# EasyEDA Pro project SCH_Workshop-components_2025-10-18.eprj

# Schematic Workshop components
Board Name: Workshop components; Create Date: 2025-10-18; Page Name: LED Lab Components; Project Name: SCH_Workshop-components_2025-10-18; Schematic Name: Workshop components; Update Date: 2025-10-18; Add into BOM: yes; Company: Your Company; Convert to PCB: yes; Date: 2025-02-25; Draw By: johncohnvt; REV: 1.0; Sheet: 1/1; spicePre: .
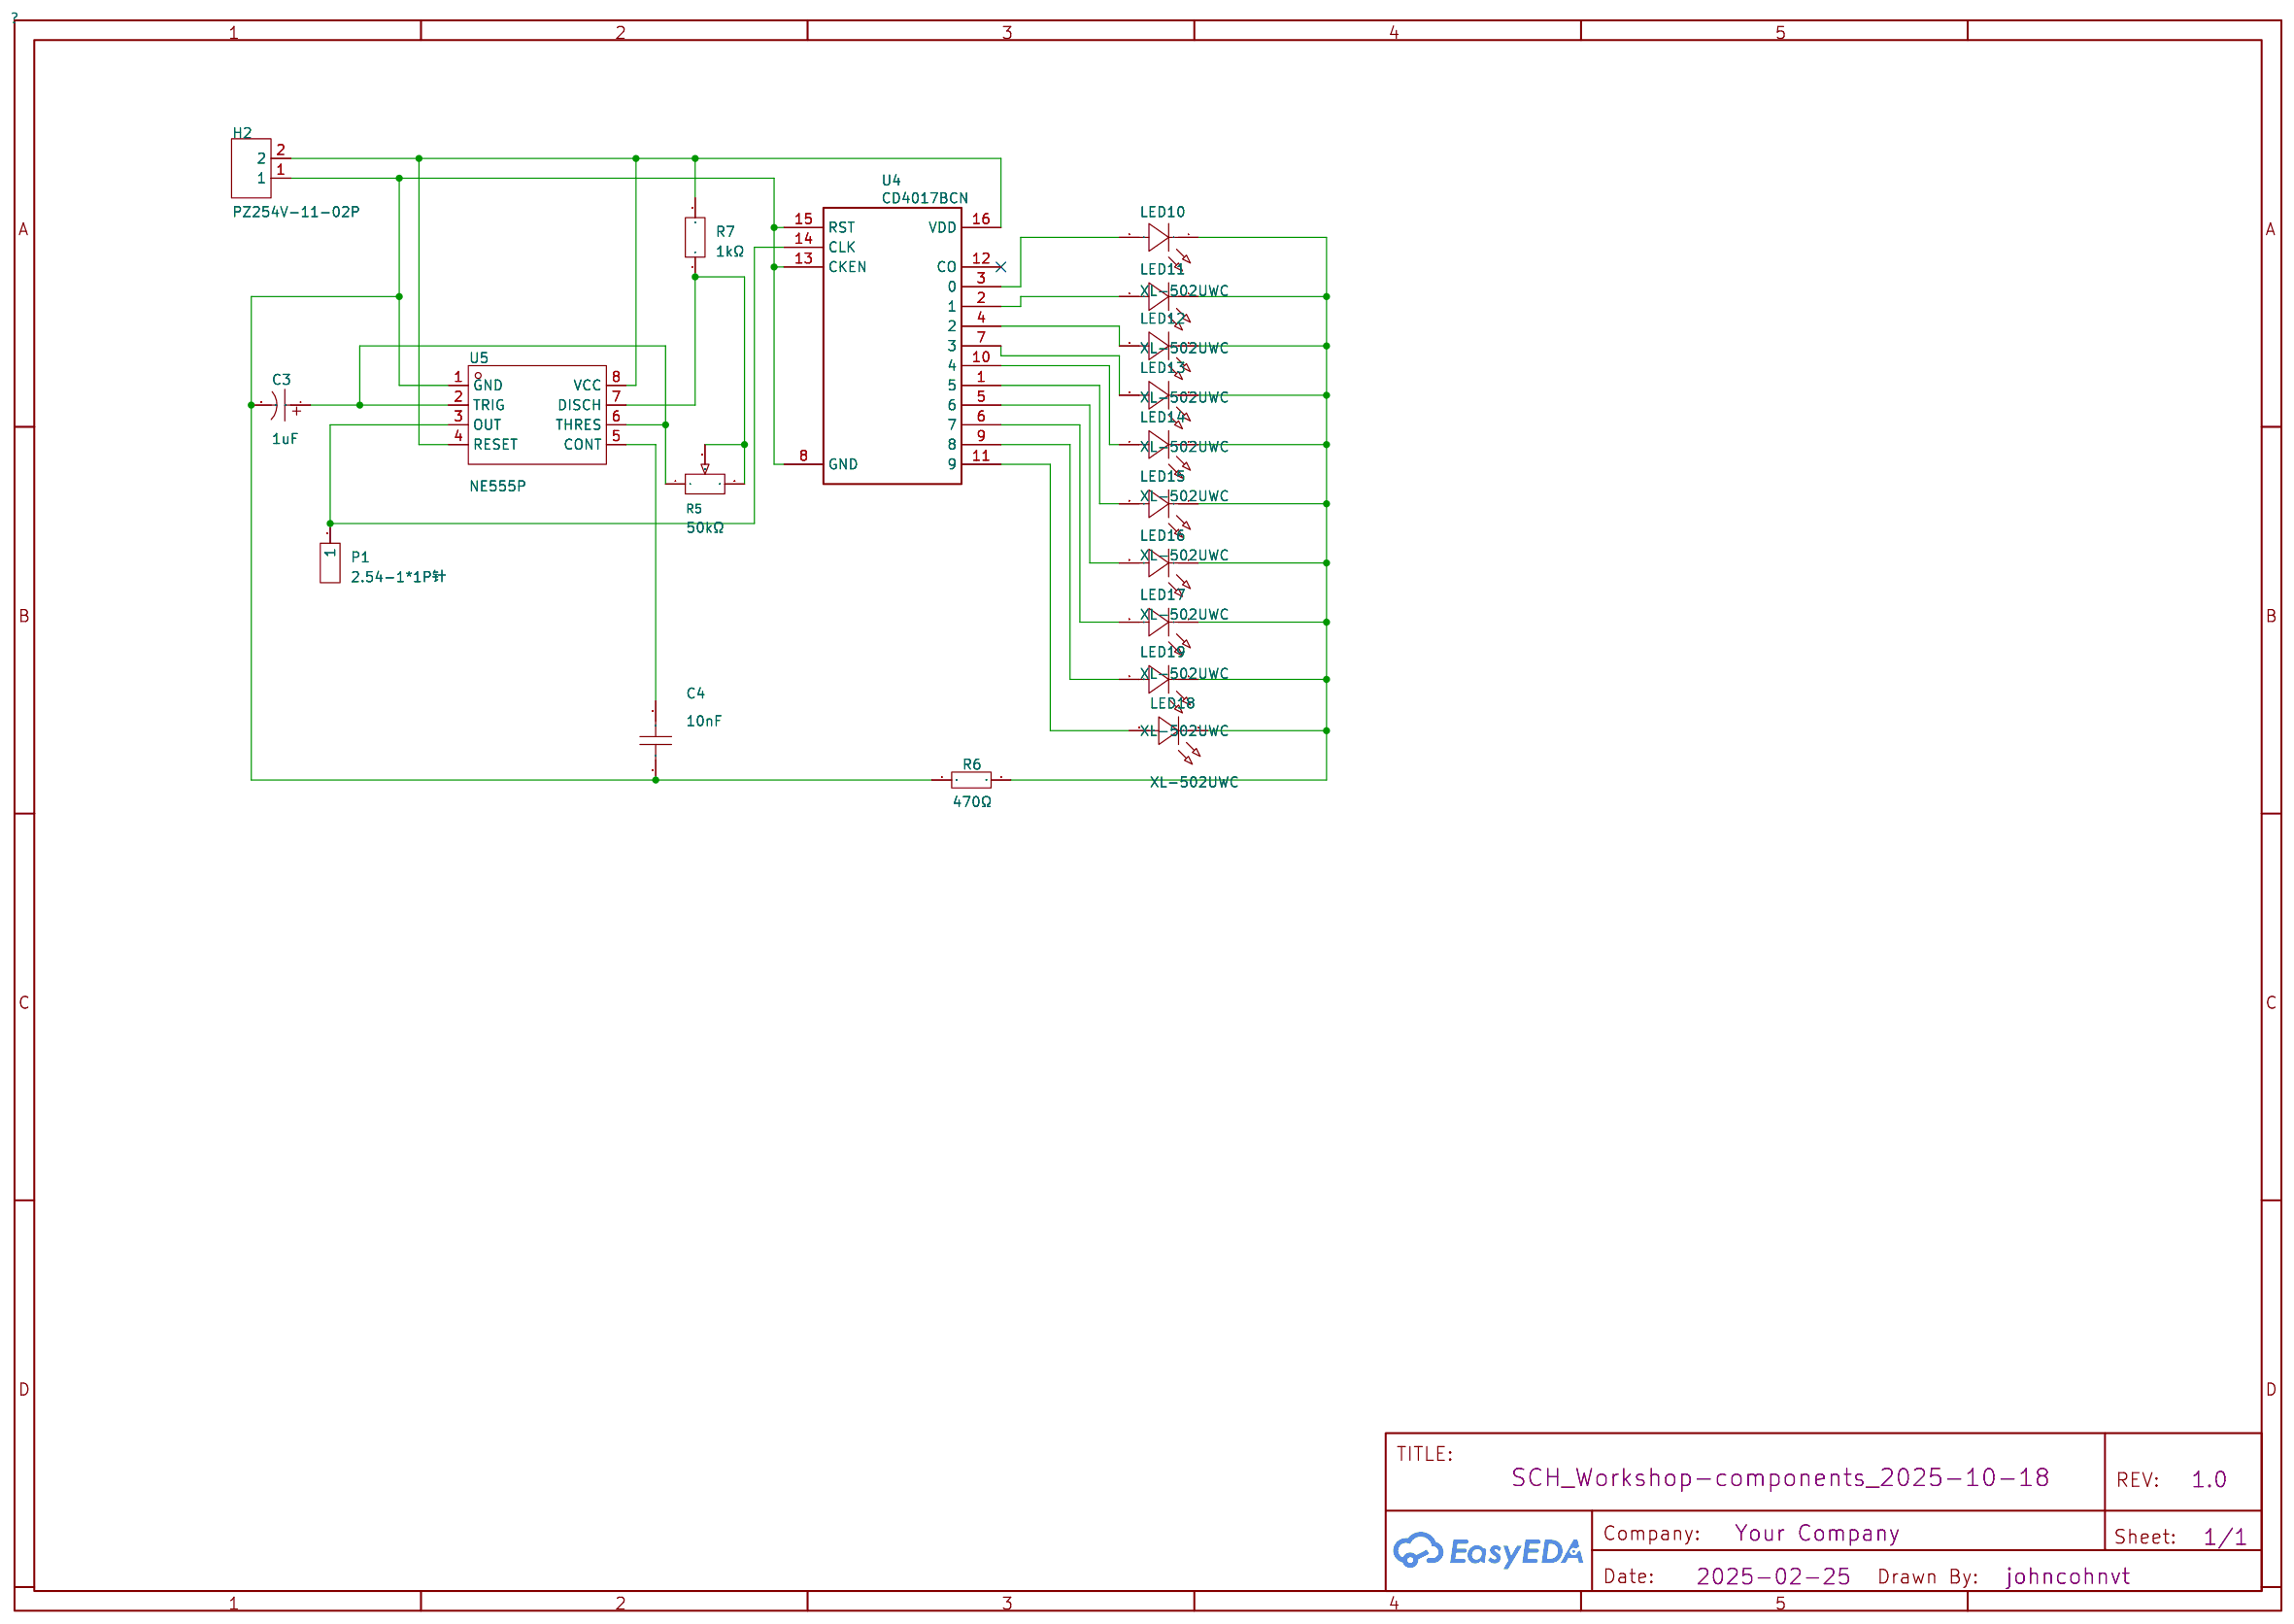
[diagram p0: schematic sheet]

## Parts
C3  1uF  [CAP-TH_BD5.0-P2.00-D0.8-FD]
C4  10nF  [CAP-TH_L8.0-W4.0-P5.00-D1.2]
H2  PZ254V-11-02P  [HDR-TH_2P-P2.54-V-M]
LED10  XL-502UWC  [LED-TH_BD5.9-P2.54-RD_WHITE]
LED11  XL-502UWC  [LED-TH_BD5.9-P2.54-RD_WHITE]
LED12  XL-502UWC  [LED-TH_BD5.9-P2.54-RD_WHITE]
LED13  XL-502UWC  [LED-TH_BD5.9-P2.54-RD_WHITE]
LED14  XL-502UWC  [LED-TH_BD5.9-P2.54-RD_WHITE]
LED15  XL-502UWC  [LED-TH_BD5.9-P2.54-RD_WHITE]
LED16  XL-502UWC  [LED-TH_BD5.9-P2.54-RD_WHITE]
LED17  XL-502UWC  [LED-TH_BD5.9-P2.54-RD_WHITE]
LED18  XL-502UWC  [LED-TH_BD5.9-P2.54-RD_WHITE]
LED19  XL-502UWC  [LED-TH_BD5.9-P2.54-RD_WHITE]
P1  2.54-1*1P针  [HDR-TH_1P-P2.54-V-M]
R5  50kΩ  [RES-ADJ-TH_3P-L9.5-W4.85-P2.50-BL-L]
R6  470Ω  [RES-TH_BD2.2-L6.5-P10.50-D0.6]
R7  1kΩ  [RES-TH_BD2.3-L6.5-P10.50-D0.5]
U4  CD4017BCN  [DIP-16_L19.8-W6.5-P2.54-LS7.6-BL]
U5  NE555P  [DIP-8_L9.8-W6.6-P2.54-LS7.6-BL]

## Library data of the parts
C3 = KF010M050C110A: LCSC Part Name: 1uF ±20% 50V; Supplier Part: C62934; Manufacturer: CapXon(丰宾); Supplier Footprint: 插件,D5xL11mm; JLCPCB Part Class: Extended Part; Datasheet: https://item.szlcsc.com/datasheet/KF010M050C110A/63997.html; Supplier: LCSC; Tolerance: ±20%; Voltage Rating: 50V; Pin Spacing: 2mm; Diameter: 5mm; Height - Seated (Max): 11mm; Lifetime: 2000hrs@105℃
C4 = N09F1B103MN0B0S0N0: LCSC Part Name: 10nF ±20% 1kV; Supplier Part: C249157; Manufacturer: STE(松田); Supplier Footprint: 插件,P=5mm; JLCPCB Part Class: Extended Part; Datasheet: https://item.szlcsc.com/datasheet/N09F1B103MN0B0S0N0/245516.html; Supplier: LCSC; Tolerance: ±20%; Voltage Rating: 1kV; Pin Spacing: 5mm; Temperature Coefficient: Y5V; Diameter: 8.5mm; Body Thickness: 2.5mm
H2 = PZ254V-11-02P: LCSC Part Name: 1x2P 间距:2.54mm 方针 直插; Supplier Part: C492401; Manufacturer: XFCN(兴飞); Supplier Footprint: 插件,P=2.54mm; JLCPCB Part Class: Extended Part; Datasheet: https://item.szlcsc.com/datasheet/PZ254V-11-02P/502957.html; Supplier: LCSC; Pin Structure: 1x2P; Pitch: 2.54mm; Circluar Pins/Square Pins: Pin Header; Mounting Type: Through Hole; Number of Rows: 1; Number of Pins: 2P; Length of Mating Pin: 6mm; Insulation Height: 2.5mm; Length of End Connection Pin: 3mm; Contact Material: Brass; Operating Temperature: -40℃~+105℃; Color: Black
LED10-LED19 = XL-502UWC: LCSC Part Name: F5白发白短脚; Supplier Part: C2895480; Manufacturer: XINGLIGHT(成兴光); Supplier Footprint: 插件,D=5mm; JLCPCB Part Class: Extended Part; Datasheet: https://item.szlcsc.com/datasheet/XL-502UWC/3136195.html; Supplier: LCSC; Lamp Holder Type: 5mm Round Lens; Illumination Color: White; Voltage - Forward(Vf): 3.3V; Power(Watts): 70mW; Forward Current: 20mA; Lens Color: Water Clear; Color Temperature: 9000K~20000K; Luminous Intensity: 20000mcd; Viewing Angle: 30°; Operating Temperature: -25℃~+85℃
P1 = 2.54-1*1P针: LCSC Part Name: 方针 直插; Supplier Part: C81276; Manufacturer: BOOMELE(博穆精密); Supplier Footprint: 插件,P=2.54mm; JLCPCB Part Class: Extended Part; Datasheet: https://item.szlcsc.com/datasheet/2.54-1*1P%25E9%2592%2588/82426.html; Supplier: LCSC; Circluar Pins/Square Pins: Pin Header; Mounting Type: Through Hole; Number of Rows: 1; Number of Pins: 1P; Current Rating: 3A; Length of Mating Pin: 6mm; Insulation Height: 2.5mm; Length of End Connection Pin: 3mm; Contact Material: Brass; Contact Plating: Gold; Operating Temperature: -55℃~+105℃; Color: Black
R5 = 3296X-1-503_C118912: LCSC Part Name: 50kΩ ±10%; Supplier Part: C118912; Manufacturer: BOCHEN(博晨); Manufacturer Part: 3296X-1-503; Supplier Footprint: 插件-3P,9.5x4.9mm; JLCPCB Part Class: Extended Part; Datasheet: https://item.szlcsc.com/datasheet/3296X-1-503/120181.html; Supplier: LCSC; Tolerance: ±10%; Power(Watts): 500mW; Temperature Coefficient: ±250ppm/℃; Number of Turns: 30
R6 = MFR0W4F4700A50: LCSC Part Name: 470Ω ±1% 250mW 金属膜电阻 铜脚，圆柱状直插; Supplier Part: C58592; Manufacturer: UNI-ROYAL(厚声); Supplier Footprint: 插件,D2.2xL6.5mm; JLCPCB Part Class: Extended Part; Datasheet: https://atta.szlcsc.com/upload/public/pdf/source/20191012/C436293_8820AA14BC71FA35E551C06C441482A0.pdf; Supplier: LCSC; Type: Metal Film Resistors; Tolerance: ±1%; Voltage-Supply(Max): 250V; Power(Watts): 250mW; Temperature Coefficient: ±50ppm/℃
R7 = MF1/4W-1KΩ±1%T52: LCSC Part Name: 金属膜电阻 1kΩ ±1% 250mW; Supplier Part: C713997; Manufacturer: 华星机电; Supplier Footprint: 插件,D2.3xL6.5mm; JLCPCB Part Class: Extended Part; Datasheet: https://atta.szlcsc.com/upload/public/pdf/source/20200731/C713882_AE8EB1102749D7E4FB4FB13DC898C429.pdf; Supplier: LCSC; Type: Metal Film Resistors; Tolerance: ±1%; Power(Watts): 250mW; Temperature Coefficient: ±200ppm/℃
U4 = CD4017BCN: Decade CounterDivider with 10 Decoded Outputs; Supplier: LCSC; Supplier Part: C32710674; spicePre: U
U5 = NE555P: Supplier Part: C46749; Manufacturer: TI(德州仪器); Supplier Footprint: DIP-8; JLCPCB Part Class: Extended Part; Datasheet: https://www.ti.com/cn/lit/gpn/ne555; Supplier: LCSC

## Nets
$1N1072: H2.2 R7.2 U4.16(VDD) U5.4(RESET) U5.8(VCC)
$1N1174: R5.2 R5.3 R7.1 U5.7(DISCH)
$1N1189: C3.1 R5.1 U5.2(TRIG) U5.6(THRES)
$1N1232: LED10.1(K) LED11.1(K) LED12.1(K) LED13.1(K) LED14.1(K) LED15.1(K) LED16.1(K) LED17.1(K) LED18.1(K) LED19.1(K) R6.2
$1N1286: C3.2 C4.1 H2.1 R6.1 U4.8(GND) U4.13(CKEN) U4.15(RST) U5.1(GND)
$1N1336: C4.2 U5.5(CONT)
$1N1648: LED10.2(A) U4.3(0)
$1N1654: LED11.2(A) U4.2(1)
$1N1661: LED12.2(A) U4.4(2)
$1N1667: LED13.2(A) U4.7(3)
$1N1685: LED14.2(A) U4.10(4)
$1N1703: LED15.2(A) U4.1(5)
$1N1710: LED16.2(A) U4.5(6)
$1N1717: LED17.2(A) U4.6(7)
$1N1724: LED19.2(A) U4.9(8)
$1N1731: LED18.2(A) U4.11(9)
$1N1752: P1.1 U4.14(CLK) U5.3(OUT)

Not connected (* = marked no-connect by the designer): U4 12(CO)*

# Board PCB2
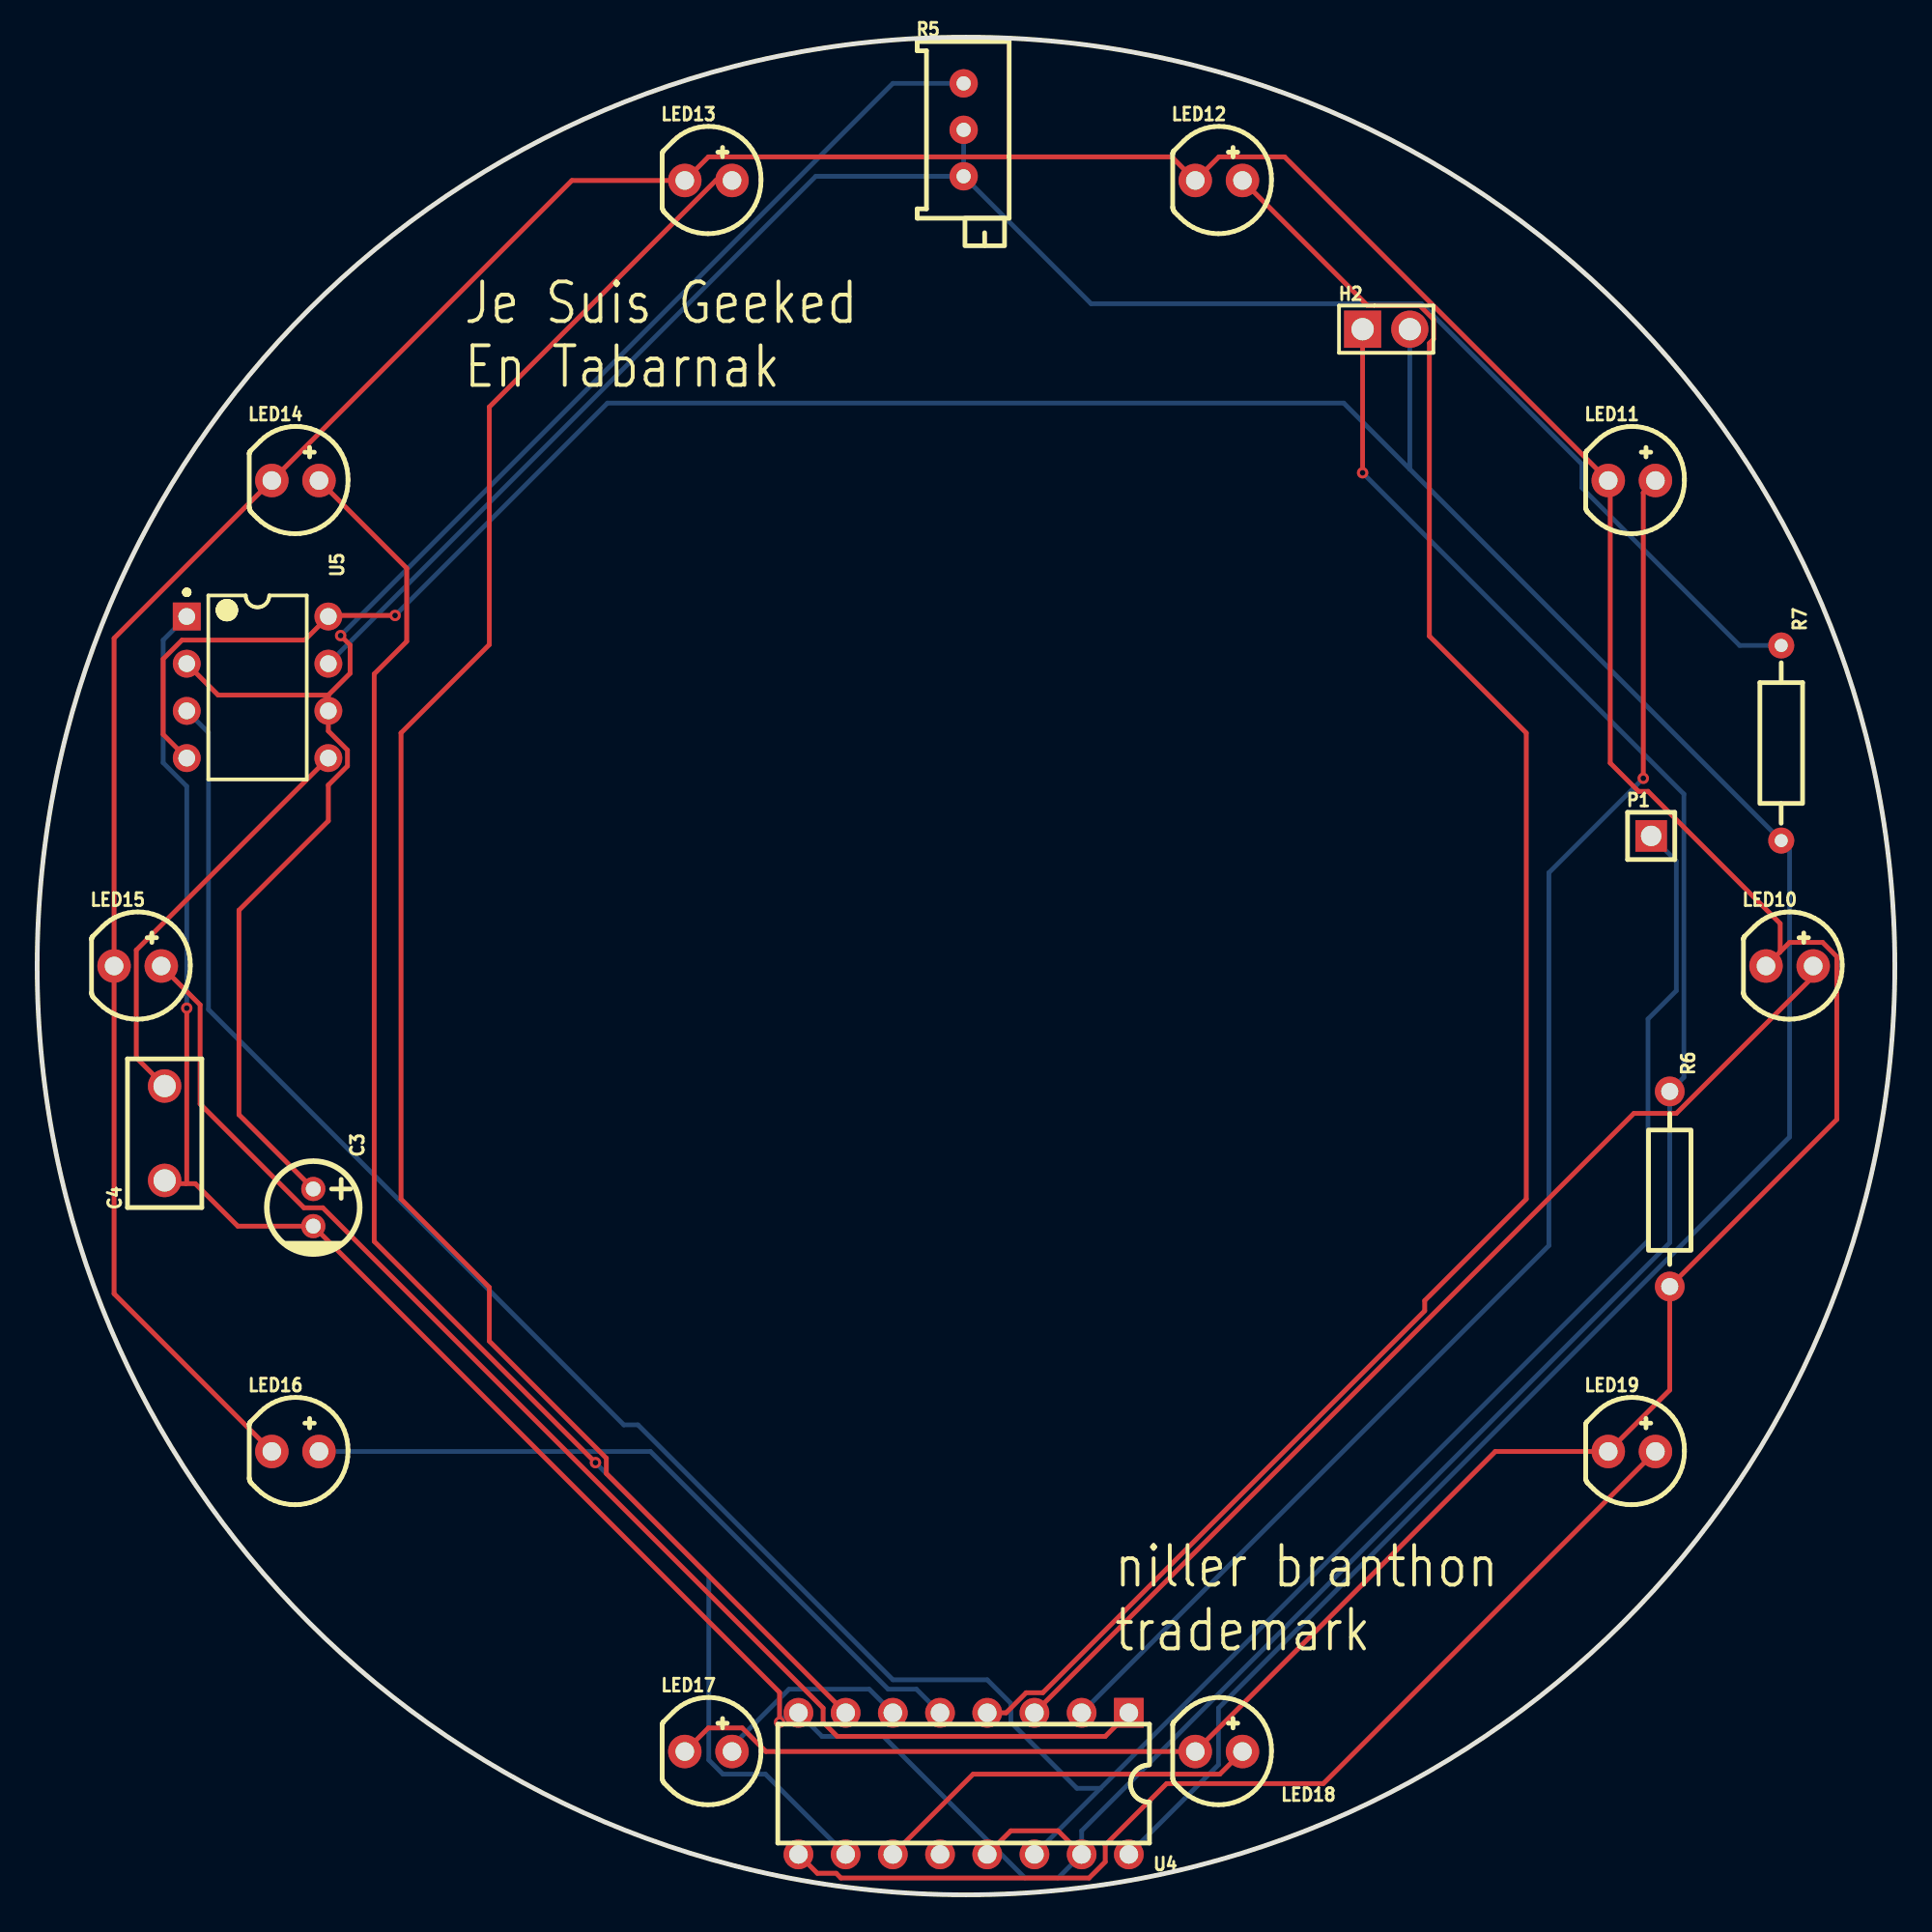
[diagram p1: board, top side]
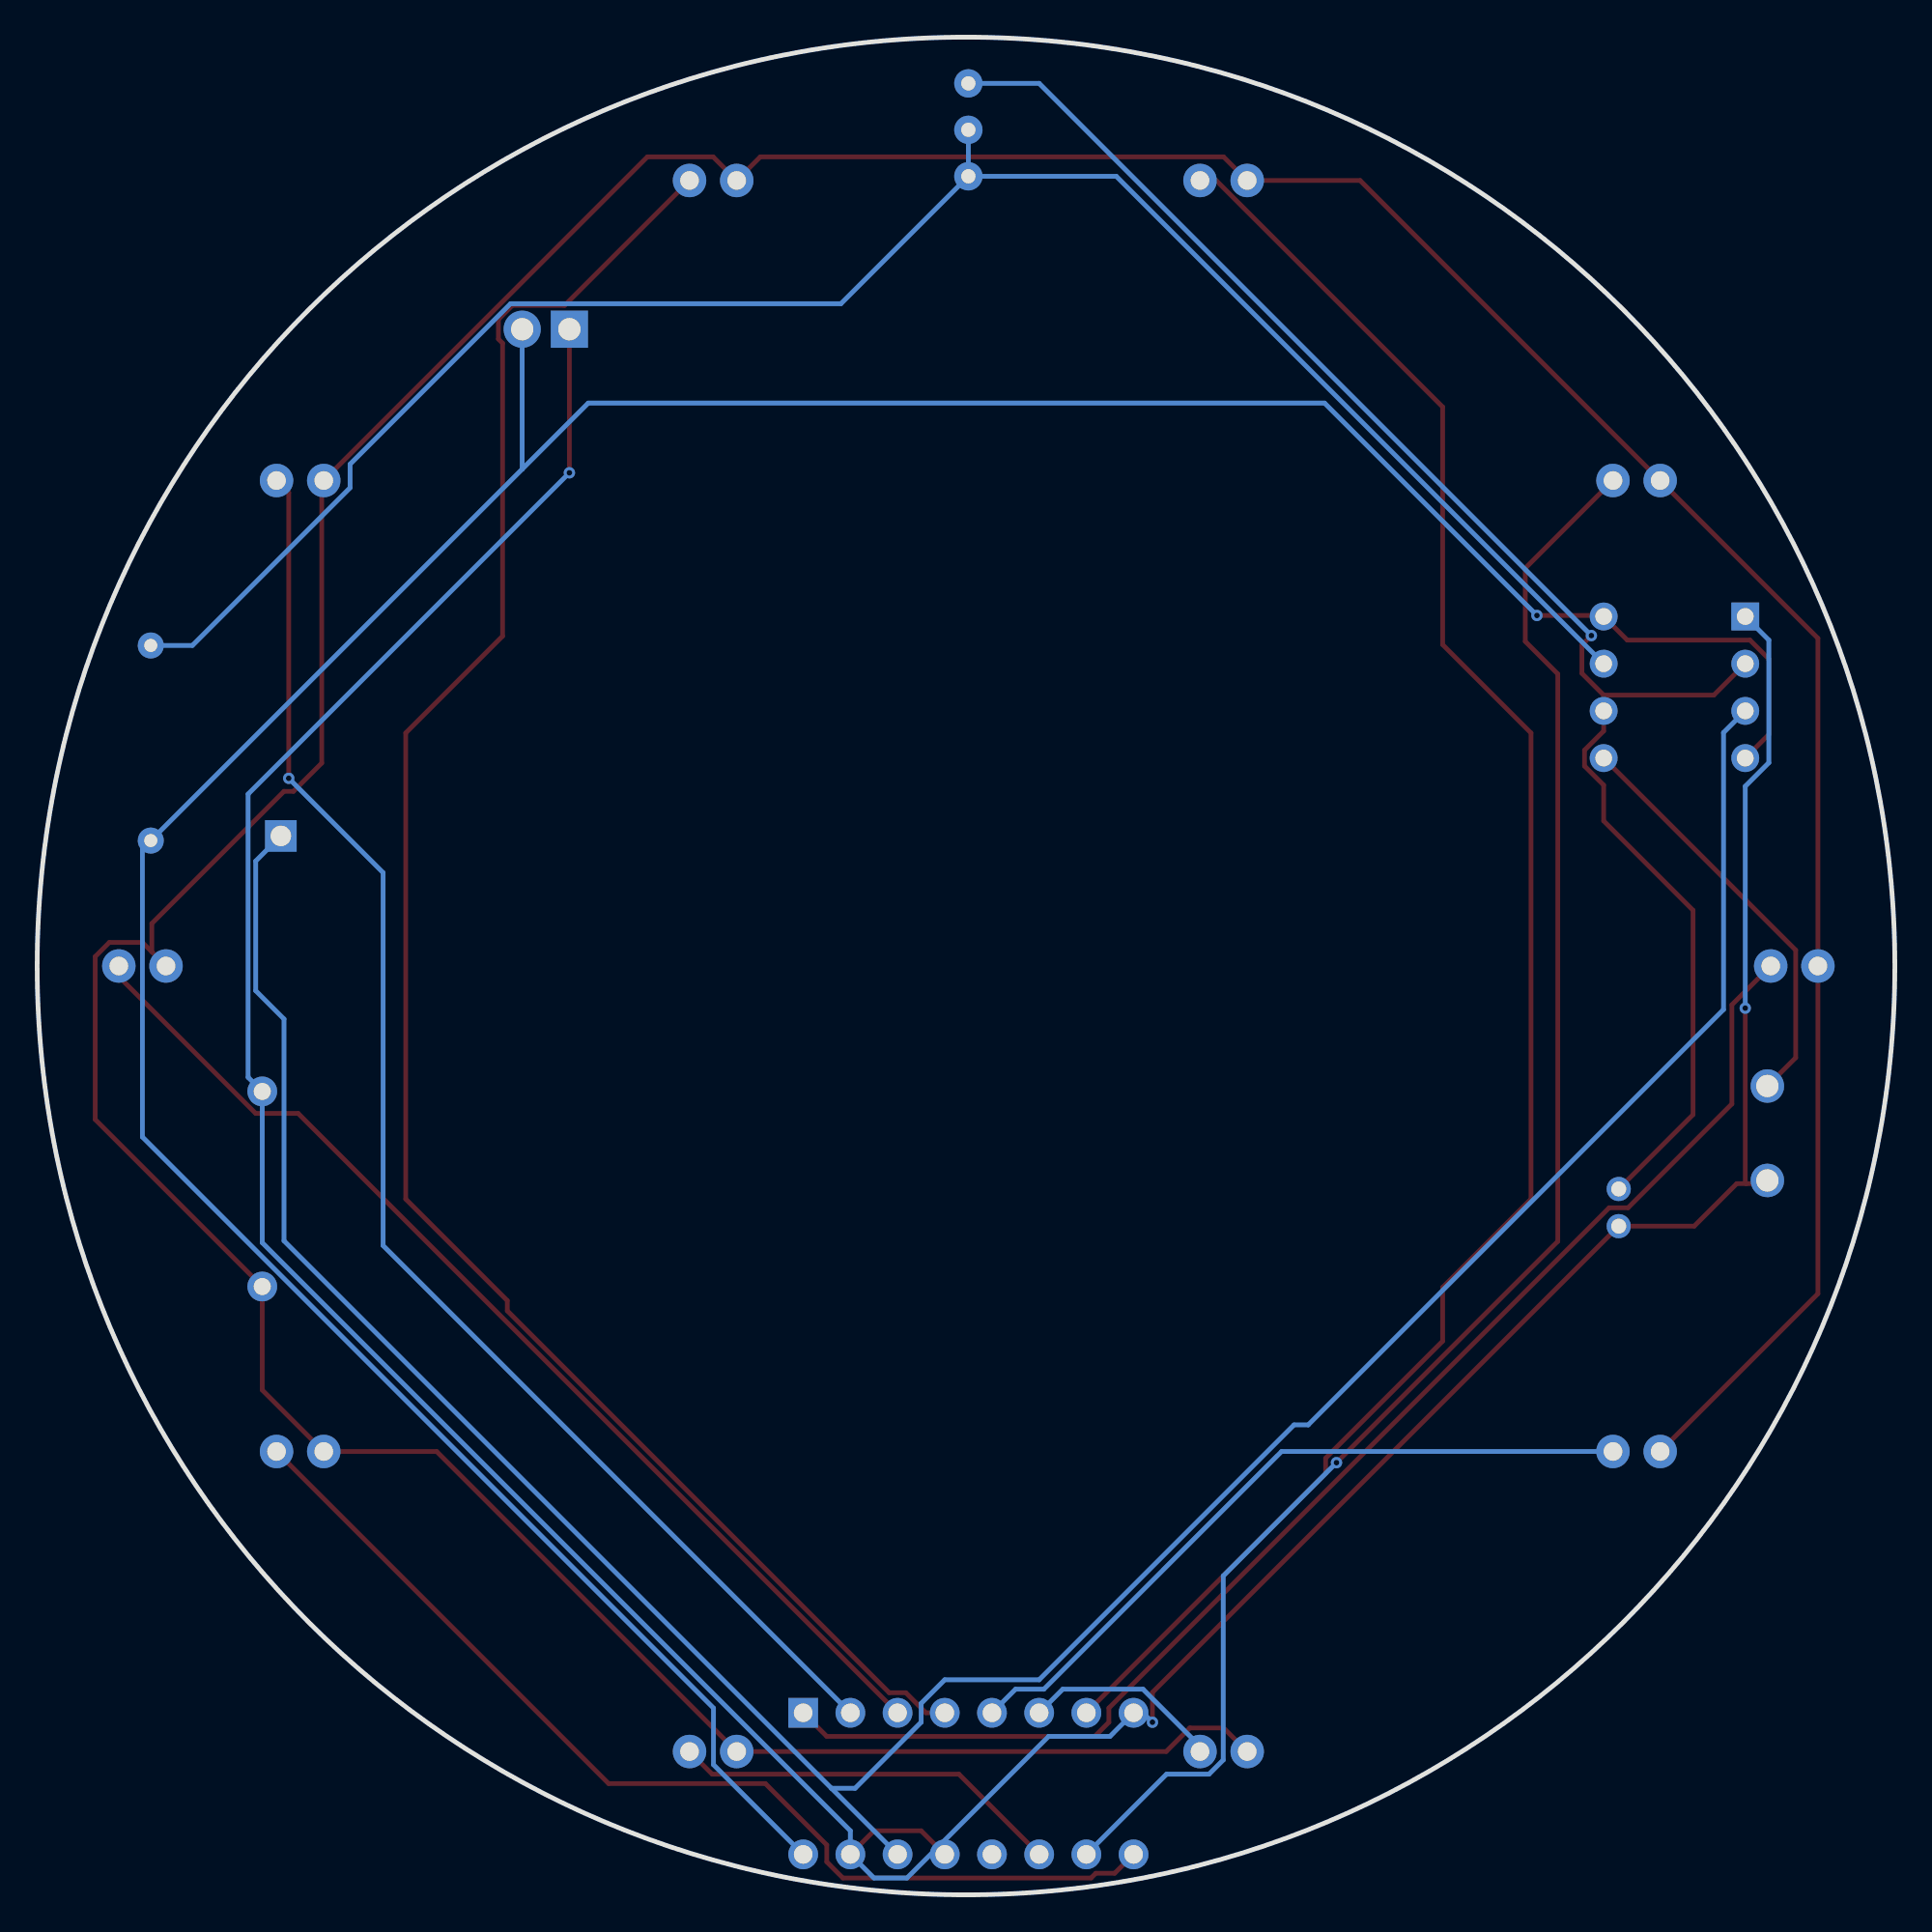
[diagram p2: board, bottom side, seen from below]

Outline 99.97 x 99.97 mm; copper layers: Top Layer, Bottom Layer. Coordinates in mm from the lower left corner of the outline.
Outline path: circle c49.99,49.99 r49.99
Stack: Top Layer 0.035mm / Dielectric1 1.51mm FR4 er 4.5 / Bottom Layer 0.035mm

## Design rules (mm)
template: JLCPCB Capability(Two Layers Board)
spacing copperThickness1oz (default): track to track 0.102, other pairs 0.152 to 0.3
spacing copperThickness2oz: track to track 0.203, other pairs 0.152 to 0.3
track width copperThickness1oz (default): min 0.127, default 0.254, max 2.54
track width copperThickness2oz: min 0.203, default 0.254, max 2.54
differential pair differentialPair (default): width min 0.127, default 0.254, max 2.54; gap min 0.152, default 0.152
via viaSize (default): diameter min 0.5, default 0.61, max 10; hole min 0.3, default 0.305, max 6.3

## Placement (name value [footprint] x y rotation side)
C3  1uF  [CAP-TH_BD5.0-P2.00-D0.8-FD]  14.86 36.99 270 top
C4  10nF  [CAP-TH_L8.0-W4.0-P5.00-D1.2]  6.86 40.99 90 top
H2  PZ254V-11-02P  [HDR-TH_2P-P2.54-V-M]  72.6 84.26 0 top
LED10  XL-502UWC  [LED-TH_BD5.9-P2.54-RD_WHITE]  94.31 49.99 0 top
LED11  XL-502UWC  [LED-TH_BD5.9-P2.54-RD_WHITE]  85.82 76.11 0 top
LED12  XL-502UWC  [LED-TH_BD5.9-P2.54-RD_WHITE]  63.6 92.26 0 top
LED13  XL-502UWC  [LED-TH_BD5.9-P2.54-RD_WHITE]  36.12 92.26 0 top
LED14  XL-502UWC  [LED-TH_BD5.9-P2.54-RD_WHITE]  13.9 76.11 0 top
LED15  XL-502UWC  [LED-TH_BD5.9-P2.54-RD_WHITE]  5.41 49.99 0 top
LED16  XL-502UWC  [LED-TH_BD5.9-P2.54-RD_WHITE]  13.9 23.86 0 top
LED17  XL-502UWC  [LED-TH_BD5.9-P2.54-RD_WHITE]  36.12 7.71 0 top
LED18  XL-502UWC  [LED-TH_BD5.9-P2.54-RD_WHITE]  63.6 7.71 0 top
LED19  XL-502UWC  [LED-TH_BD5.9-P2.54-RD_WHITE]  85.82 23.86 0 top
P1  2.54-1*1P针  [HDR-TH_1P-P2.54-V-M]  86.86 56.99 0 top
R5  50kΩ  [RES-ADJ-TH_3P-L9.5-W4.85-P2.50-BL-L]  49.86 94.99 0 top
R6  470Ω  [RES-TH_BD2.2-L6.5-P10.50-D0.6]  87.86 37.99 270 top
R7  1kΩ  [RES-TH_BD2.3-L6.5-P10.50-D0.5]  93.86 61.99 270 top
U4  CD4017BCN  [DIP-16_L19.8-W6.5-P2.54-LS7.6-BL]  49.86 5.99 180 top
U5  NE555P  [DIP-8_L9.8-W6.6-P2.54-LS7.6-BL]  11.86 64.99 270 top

## Footprints (pads in the part's own frame, mm; a bottom-side part is the same pattern mirrored in y, then rotated)
CAP-TH_BD5.0-P2.00-D0.8-FD
  round 1.3 hole 0.8: 1(-1,0) 2(1,0)
CAP-TH_L8.0-W4.0-P5.00-D1.2
  round 1.8 hole 1.2: 1(-2.54,0) 2(2.54,0)
DIP-8_L9.8-W6.6-P2.54-LS7.6-BL
  rect 1.5x1.5 hole 0.9: 1(-3.81,-3.81)
  round 1.5 hole 0.9: 2(-1.27,-3.81) 3(1.27,-3.81) 4(3.81,-3.81) 5(3.81,3.81) 6(1.27,3.81) 7(-1.27,3.81) 8(-3.81,3.81)
DIP-16_L19.8-W6.5-P2.54-LS7.6-BL
  rect 1.6x1.6 hole 1: 1(-8.89,-3.81)
  round 1.6 hole 1: 2(-6.35,-3.81) 3(-3.81,-3.81) 4(-1.27,-3.81) 5(1.27,-3.81) 6(3.81,-3.81) 7(6.35,-3.81) 8(8.89,-3.81) 9(8.89,3.81) 10(6.35,3.81) 11(3.81,3.81) 12(1.27,3.81) 13(-1.27,3.81) 14(-3.81,3.81) 15(-6.35,3.81) 16(-8.89,3.81)
HDR-TH_1P-P2.54-V-M
  rect 1.7x1.7 hole 1.1: 1(0,0)
HDR-TH_2P-P2.54-V-M
  rect 2x2 hole 1.2: 1(-1.27,0)
  round 2 hole 1.2: 2(1.27,0)
LED-TH_BD5.9-P2.54-RD_WHITE
  round 1.8 hole 1: 1(-1.27,0) 2(1.27,0)
RES-ADJ-TH_3P-L9.5-W4.85-P2.50-BL-L
  round 1.524 hole 0.762: 1(0,2.5) 2(0,0) 3(0,-2.5)
RES-TH_BD2.2-L6.5-P10.50-D0.6
  round 1.6 hole 0.914: 1(-5.25,0) 2(5.25,0)
RES-TH_BD2.3-L6.5-P10.50-D0.5
  round 1.4 hole 0.7: 1(-5.25,0) 2(5.25,0)

## Nets
As in the schematic.

Pads without a net: U4 12

## Via types
v1: diameter 0.61, hole 0.305, Top Layer to Bottom Layer, 7 vias

## Routing (per net, layer and track width the routed paths; a pad name or vN(x,y) marks a point on that pad's centre or on a via; arc(x,y) is an arc through that point)
$1N1072: length 185.4
  Top Layer w0.254: v1(19.26,68.85) 15.72,68.85 U5.8 14.4,67.53 7.8,67.53 6.78,66.51 6.78,62.45 U5.4
  Bottom Layer w0.254: 73.87,76.73 H2.2 ; 73.87,76.73 R7.2 94.31,56.29 94.31,40.78 63.58,10.05 63.58,7 U4.16 ; 73.87,76.73 70.32,80.28 30.69,80.28 v1(19.26,68.85)
$1N1174: length 102.8
  Bottom Layer w0.254: U5.7 41.9,92.49 R5.3 ; R5.2 R5.3 ; R5.3 56.72,85.63 74.5,85.63 83.13,76.99 83.13,75.72 91.62,67.24 R7.1
$1N1189: length 89.1
  Top Layer w0.254: 15.67,64.57 9.74,64.57 U5.2 ; 15.67,64.57 16.84,65.74 16.84,67.26 v1(16.33,67.77) ; 15.67,64.57 U5.6 15.67,62.63 16.7,61.6 16.7,60.75 15.67,59.72 15.67,57.8 10.86,52.99 10.86,41.99 C3.1
  Bottom Layer w0.254: v1(16.33,67.77) 46.05,97.49 R5.1
$1N1232: length 270
  Top Layer w0.254: 93.8,50.75 94.31,51.26 96.09,51.26 96.85,50.49 96.85,41.73 R6.2 87.86,27.17 LED19.1 78.47,23.86 LED18.1 39.21,7.71 37.94,8.98 36.12,8.98 LED17.1 ; 93.8,50.75 93.8,52.27 86.69,59.38 86.18,59.38 84.66,60.91 84.66,76.01 LED11.1 67.13,93.53 63.6,93.53 LED12.1 61.06,93.53 36.12,93.53 LED13.1 28.78,92.26 LED14.1 4.14,67.62 LED15.1 4.14,32.35 LED16.1 ; 93.8,50.75 LED10.1
$1N1286: length 207.2
  Top Layer w0.254: U4.15 54.94,3.45 52.4,3.45 U4.13 ; v1(39.95,9.29) 39.95,10.89 C3.2 10.8,35.99 8.51,38.27 8,38.27 ; 8,38.27 8.05,38.32 v1(8.05,47.72) ; 8,38.27 7.03,38.27 C4.1 ; v1(71.33,76.53) H2.1
  Bottom Layer w0.254: v1(39.95,9.29) 40.46,9.8 U4.8 42.24,8.53 45.54,8.53 53.16,0.91 54.94,0.91 U4.15 56.21,3.45 87.86,35.1 R6.1 88.62,44 88.62,59.24 v1(71.33,76.53) ; U5.1 6.78,67.53 6.78,60.93 8.05,59.66 v1(8.05,47.72)
$1N1336: length 22.6
  Top Layer w0.254: C4.2 5.34,45.05 5.34,50.84 U5.5
$1N1648: length 58.9
  Top Layer w0.254: U4.3 85.93,42.05 88.21,42.05 95.58,49.42 LED10.2
$1N1654: length 79.1
  Top Layer w0.254: LED11.2 86.44,75.46 v1(86.44,60.09)
  Bottom Layer w0.254: U4.2 81.36,34.94 81.36,55.01 v1(86.44,60.09)
$1N1661: length 103.8
  Top Layer w0.254: LED12.2 71.59,85.54 74.4,85.54 75.15,84.79 75.15,83.73 74.93,83.5 74.93,67.74 80.14,62.53 80.14,37.44 74.67,31.98 74.67,31.43 54.12,10.88 53.22,10.88 52.14,9.8 U4.4
$1N1667: length 100.3
  Top Layer w0.254: U4.7 30.63,22.67 30.63,23.5 24.33,29.8 24.33,32.69 19.58,37.44 19.58,62.53 24.33,67.28 24.33,80.07 36.52,92.26 LED13.2
$1N1685: length 88.5
  Top Layer w0.254: LED14.2 19.89,71.4 19.89,67.45 18.14,65.71 18.14,35.17 v1(30.05,23.26)
  Bottom Layer w0.254: U4.10 39.19,6.5 36.91,6.5 36.14,7.26 36.14,17.16 v1(30.05,23.26)
$1N1703: length 73.3
  Top Layer w0.254: LED15.2 8.77,47.9 8.77,42.56 14.36,36.97 15.37,36.97 42.3,10.05 42.3,9.29 43.06,8.53 57.48,8.53 U4.1
$1N1710: length 39.2
  Bottom Layer w0.254: LED16.2 33,23.86 45.8,11.07 47.32,11.07 U4.5
$1N1717: length 10.7
  Bottom Layer w0.254: LED17.2 37.39,8 40.46,11.07 44.78,11.07 U4.6
$1N1724: length 56.7
  Top Layer w0.254: LED19.2 69.22,5.99 60.78,5.99 57.48,2.69 57.48,1.78 56.61,0.91 43.26,0.91 43,1.16 41.99,1.16 U4.9
$1N1731: length 21.1
  Top Layer w0.254: U4.11 50.37,6.5 63.65,6.5 LED18.2
$1N1752: length 152.2
  Bottom Layer w0.254: P1.1 88.21,55.63 88.21,48.66 86.69,47.13 86.69,35.2 57.23,5.73 ; 57.23,5.73 U4.14 ; 57.23,5.73 55.96,5.73 52.4,9.29 52.4,10.31 51.13,11.57 46.05,11.57 32.33,25.29 31.57,25.29 9.22,47.64 9.22,62.55 U5.3

## Text on the board
Top Silkscreen Layer: Je Suis Geeked / En Tabarnak | niller branthon / trademark
